# Altium schematic sheet Microcontroller (MCU).SchDoc
size A4; SheetNumber: 10; SheetTotal: 10
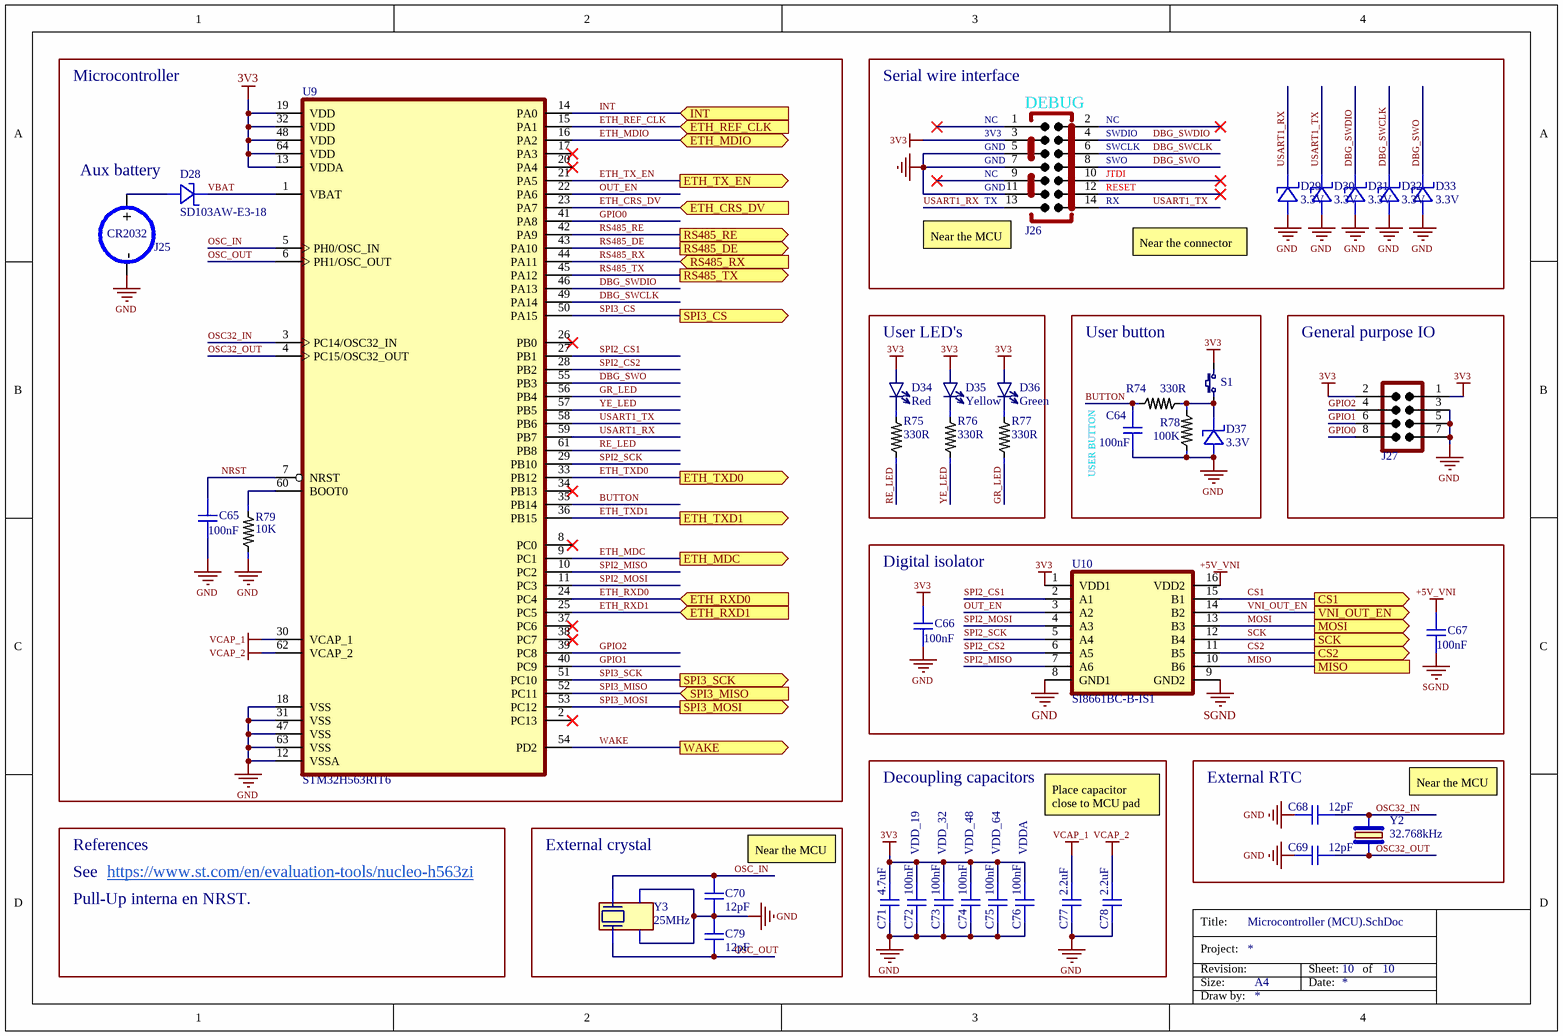
[diagram p0: Microcontroller (MCU).SchDoc]

## Parts
C64  value 100nF  [CAPC1005N]  (hidden comment: Multilayer Ceramic Capacitors)
C65  value 100nF  [CAPC1005N]  (hidden comment: Multilayer Ceramic Capacitors)
C66  value 100nF  [CAPC1005N]  (hidden comment: Multilayer Ceramic Capacitors)
C67  value 100nF  [CAPC1005N]  (hidden comment: Multilayer Ceramic Capacitors)
C68  value 12pF  [CAPC1005N]  (hidden comment: Multilayer Ceramic Capacitors)
C69  value 12pF  [CAPC1005N]  (hidden comment: Multilayer Ceramic Capacitors)
C70  value 12pF  [CAPC1005N]  (hidden comment: Multilayer Ceramic Capacitors)
C71  value 4.7uF  [CAPC1005N]  (hidden comment: Multilayer Ceramic Capacitors)
C72  value 100nF  [CAPC1005N]  (hidden comment: Multilayer Ceramic Capacitors)
C73  value 100nF  [CAPC1005N]  (hidden comment: Multilayer Ceramic Capacitors)
C74  value 100nF  [CAPC1005N]  (hidden comment: Multilayer Ceramic Capacitors)
C75  value 100nF  [CAPC1005N]  (hidden comment: Multilayer Ceramic Capacitors)
C76  value 100nF  [CAPC1005N]  (hidden comment: Multilayer Ceramic Capacitors)
C77  value 2.2uF  [CAPC1005N]  (hidden comment: Multilayer Ceramic Capacitors)
C78  value 2.2uF  [CAPC1005N]  (hidden comment: Multilayer Ceramic Capacitors)
C79  value 12pF  [CAPC1005N]  (hidden comment: Multilayer Ceramic Capacitors)
D28  Part Number: SD103AW-E3-18  [SOD3705X110-2N]  (hidden comment: Schottky Diodes)
D29  value 3.3V  [SOD2512X110N]  (hidden comment: ESD Protection Diodes)
D30  value 3.3V  [SOD2512X110N]  (hidden comment: ESD Protection Diodes)
D31  value 3.3V  [SOD2512X110N]  (hidden comment: ESD Protection Diodes)
D32  value 3.3V  [SOD2512X110N]  (hidden comment: ESD Protection Diodes)
D33  value 3.3V  [SOD2512X110N]  (hidden comment: ESD Protection Diodes)
D34  value Red  [LEDC1608X80N_RED]  (hidden comment: Single Color LED)
D35  value Yellow  [LEDC1608X80N_YELLOW]  (hidden comment: Single Color LED)
D36  value Green  [LEDC1608X80N_GREEN]  (hidden comment: Single Color LED)
D37  value 3.3V  [SOD2512X110N]  (hidden comment: ESD Protection Diodes)
J25  Cell Battery Holders  [CONB_BH_CR2032-2N]  (value not drawn)
J26  Male straight header  [CONH_ML127P-14N]  (value not drawn)
J27  Male straight header  [CONH_ML254P-SMT-8N]  (value not drawn)
R74  value 330R  [RESC1005N]  (hidden comment: Thick Film Resistors)
R75  value 330R  [RESC1005N]  (hidden comment: Thick Film Resistors)
R76  value 330R  [RESC1005N]  (hidden comment: Thick Film Resistors)
R77  value 330R  [RESC1005N]  (hidden comment: Thick Film Resistors)
R78  value 100K  [RESC1005N]  (hidden comment: Thick Film Resistors)
R79  value 10K  [RESC1005N]  (hidden comment: Thick Film Resistors)
S1  Tactile Switches  [PKG3.5X6-2N]  (value not drawn)
U9  Part Number: STM32H563RIT6  [QFP50P1200X1200X160-64N]  (hidden comment: ARM Cortex M33 MCU)
U10  Part Number: SI8661BC-B-IS1  [SOIC127P1030X265-16N]  (hidden comment: Digital Isolators)
Y2  value 32.768kHz  [XTAL3215]  (hidden comment: Crystal)
Y3  value 25MHz  [XTAL3225]  (hidden comment: Crystal)

## Blocks framed on the sheet
User LED's: D34-D36 R75-R77
User button: C64 D37 R74 R78 S1
General purpose IO: J27
Digital isolator: C66 C67 U10
Decoupling capacitors: C71-C78
External RTC: C68 C69 Y2
External crystal: C70 C79 Y3

## Ports
CS1 (out, see Main[3C], Digital Input (DIN)[1C]), CS2 (out, see Main[3C], Digital Output (DOUT)[1C]), ETH_CRS_DV (in, see Main[2B], Ethernet Interface (ETH)[2B]), ETH_MDC (out, see Main[2B], Ethernet Interface (ETH)[2B]), ETH_MDIO (bidir, see Main[2B], Ethernet Interface (ETH)[2B]), ETH_REF_CLK (in, see Main[2B], Ethernet Interface (ETH)[2B]), ETH_RXD0 (in, see Main[2B], Ethernet Interface (ETH)[2B]), ETH_RXD1 (in, see Main[2B], Ethernet Interface (ETH)[2B]), ETH_TX_EN (out, see Main[2B], Ethernet Interface (ETH)[2B]), ETH_TXD0 (out, see Main[2B], Ethernet Interface (ETH)[2A]), ETH_TXD1 (out, see Main[2B], Ethernet Interface (ETH)[2B]), INT (in, see Main[2C], RF Transceiver Module (RF)[1B]), MISO (see Main[3C], Digital Input (DIN)[1C], Digital Output (DOUT)[1C]), MOSI (out, see Main[3B], Digital Input (DIN)[1C], Digital Output (DOUT)[1C]), RS485_DE (out, see Main[3B], Industrial Serial Comm (RS485)[1B]), RS485_RE (out, see Main[3B], Industrial Serial Comm (RS485)[1B]), RS485_RX (in, see Main[3B], Industrial Serial Comm (RS485)[1B]), RS485_TX (out, see Main[3B], Industrial Serial Comm (RS485)[1B]), SCK (out, see Main[3C], Digital Input (DIN)[1C], Digital Output (DOUT)[1C]), SPI3_CS (out, see Main[2C], RF Transceiver Module (RF)[2B]), SPI3_MISO (in, see Main[2C], RF Transceiver Module (RF)[2B]), SPI3_MOSI (out, see Main[2C], RF Transceiver Module (RF)[1B]), SPI3_SCK (out, see Main[2C], RF Transceiver Module (RF)[1B]), VNI_OUT_EN (out, see Main[3C], Digital Output (DOUT)[2B]), WAKE (out, see Main[2C], RF Transceiver Module (RF)[1B])

## Nets
3V3: C66.1 C71.1 C72.1 C73.1 C74.1 C75.1 C76.1 D34.A D35.A D36.A J26.3 J27.1 J27.2 S1.2 U9.13(VDDA) U9.19(VDD) U9.32(VDD) U9.48(VDD) U9.64(VDD) U10.1(VDD1)
+5V_VNI: C67.1 U10.16(VDD2)
GND: C64.2 C65.2 C66.2 C68.2 C69.2 C70.2 C71.2 C72.2 C73.2 C74.2 C75.2 C76.2 C77.2 C78.2 C79.1 D29.A D30.A D31.A D32.A D33.A D37.A J25.1(-) J26.5 J26.7 J26.11 J27.3 J27.5 J27.7 R78.1 R79.1 U9.12(VSSA) U9.18(VSS) U9.31(VSS) U9.47(VSS) U9.63(VSS) U10.8(GND1) Y3.2(GND) Y3.4(GND)
SGND: C67.2 U10.9(GND2)
VCAP_1: C77.1 U9.30(VCAP_1)
VCAP_2: C78.1 U9.62(VCAP_2)
BUTTON: C64.1 R74.1 U9.35(PB14)
CS1: U10.15(B1) ; port CS1
CS2: U10.11(B5) ; port CS2
DBG_SWCLK: D32.C J26.6 U9.49(PA14)
DBG_SWDIO: D31.C J26.4 U9.46(PA13)
DBG_SWO: D33.C J26.8 U9.55(PB3)
ETH_CRS_DV: U9.23(PA7) ; port ETH_CRS_DV
ETH_MDC: U9.9(PC1) ; port ETH_MDC
ETH_MDIO: U9.16(PA2) ; port ETH_MDIO
ETH_REF_CLK: U9.15(PA1) ; port ETH_REF_CLK
ETH_RXD0: U9.24(PC4) ; port ETH_RXD0
ETH_RXD1: U9.25(PC5) ; port ETH_RXD1
ETH_TX_EN: U9.21(PA5) ; port ETH_TX_EN
ETH_TXD0: U9.33(PB12) ; port ETH_TXD0
ETH_TXD1: U9.36(PB15) ; port ETH_TXD1
GPIO0: J27.8 U9.41(PA8)
GPIO1: J27.6 U9.40(PC9)
GPIO2: J27.4 U9.39(PC8)
GR_LED: R77.1 U9.56(PB4)
INT: U9.14(PA0) ; port INT
MISO: U10.10(B6) ; port MISO
MOSI: U10.13(B3) ; port MOSI
NRST: C65.1 U9.7(NRST)
OSC32_IN: C68.1 U9.3(PC14/OSC32_IN) Y2.2(CRYSTAL)
OSC32_OUT: C69.1 U9.4(PC15/OSC32_OUT) Y2.1(CRYSTAL)
OSC_IN: C70.1 U9.5(PH0/OSC_IN) Y3.1(IN/OUT)
OSC_OUT: C79.2 U9.6(PH1/OSC_OUT) Y3.3(OUT/IN)
OUT_EN: U9.22(PA6) U10.3(A2)
RE_LED: R75.1 U9.61(PB8)
RS485_DE: U9.43(PA10) ; port RS485_DE
RS485_RE: U9.42(PA9) ; port RS485_RE
RS485_RX: U9.44(PA11) ; port RS485_RX
RS485_TX: U9.45(PA12) ; port RS485_TX
SCK: U10.12(B4) ; port SCK
SPI2_CS1: U9.27(PB1) U10.2(A1)
SPI2_CS2: U9.28(PB2) U10.6(A5)
SPI2_MISO: U9.10(PC2) U10.7(A6)
SPI2_MOSI: U9.11(PC3) U10.4(A3)
SPI2_SCK: U9.29(PB10) U10.5(A4)
SPI3_CS: U9.50(PA15) ; port SPI3_CS
SPI3_MISO: U9.52(PC11) ; port SPI3_MISO
SPI3_MOSI: U9.53(PC12) ; port SPI3_MOSI
SPI3_SCK: U9.51(PC10) ; port SPI3_SCK
USART1_RX: D29.C J26.13 U9.59(PB7)
USART1_TX: D30.C J26.14 U9.58(PB6)
VBAT: D28.C U9.1(VBAT)
VNI_OUT_EN: U10.14(B2) ; port VNI_OUT_EN
WAKE: U9.54(PD2) ; port WAKE
YE_LED: R76.1 U9.57(PB5)
NetD28_A: D28.A J25.2(+)
NetD34_C: D34.C R75.2
NetD35_C: D35.C R76.2
NetD36_C: D36.C R77.2
NetD37_C: D37.C R74.2 R78.2 S1.1
NetR79_2: R79.2 U9.60(BOOT0)

Not connected (* = marked no-connect by the designer): J26 1* 2* 9* 10* 12*; U9 2(PC13)* 8(PC0)* 17(PA3)* 20(PA4)* 26(PB0)* 34(PB13)* 37(PC6)* 38(PC7)*

## Notes on the sheet
- Microcontroller
- (near J26) Serial wire interface
- (near J26) DEBUG
- Aux battery
- (near J26) NC
- (near J26) GND
- (near J26) 3V3
- (near J26) SWO
- (near J26) SWCLK
- (near J26) SWDIO
- (near J26) JTDI
- (near J26) Near the MCU
- (near J26) TX
- (near J26) RX
- (near J26) RESET
- Near the connector
- USER BUTTON
- (near Y2) Near the MCU
- References
- VDD_19
- VDD_32
- VDD_48
- VDD_64
- VDDA
- Place capacitor close to MCU pad
- See
- Pull-Up interna en NRST.
- https://www.st.com/en/evaluation-tools/nucleo-h563zi
- Near the MCU
- Title:
- Project:
- Revision:
- Size:
- A4
- Sheet:
- Date:
- of
- Draw by:
- (in symbol J-CR2032-H-SMT) CR2032

## Library data of the parts
C64-C67 C72-C76 = C-MLCC-100nF-50V-10%-0402: Multilayer Ceramic Capacitors MLCC - SMD/SMT 50 V 0.1uF X7R 0402 10%; Part Number: CC0402KRX5R9BB104; Manufacturer: YAGEO; Mounting Type: SMT; Mouser Part #: 603-CC402KRX5R9BB104; Digikey Part #: 311-3342-1-ND; JLCPCB Part #: C105882
C68-C70 C79 = C-MLCC-12pF-50V-10%-0402: Multilayer Ceramic Capacitors MLCC - SMD/SMT 50 V 12 pF C0G 0402 1%; Part Number: CC0402FRNPO9BN120; Manufacturer: YAGEO; Mounting Type: SMT; Mouser Part #: 603-CC402FRNPO9BN120; Digikey Part #: 311-1641-1-ND; JLCPCB Part #: C326662
C71 = C-MLCC-4.7uF-10V-10%-0402: Multilayer Ceramic Capacitors MLCC - SMD/SMT 10V 4.7uF X5R 0402 10% HI CV; Part Number: CC0402KRX5R6BB475; Manufacturer: YAGEO; Mounting Type: SMT; Mouser Part #: 603-CC0402KR5R6BB475; Digikey Part #: 13-CC0402KRX5R6BB475CT-ND; JLCPCB Part #: C326586
C77 C78 = C-MLCC-2.2uF-25V-10%-0402: Multilayer Ceramic Capacitors MLCC - SMD/SMT 25V 2.2uF X5R 0402 10% HI CV; Part Number: CC0402KRX5R8BB225; Manufacturer: YAGEO; Mounting Type: SMT; Mouser Part #: 603-CC0402KRX5R8B225; Digikey Part #: 13-CC0402KRX5R8BB225CT-ND; JLCPCB Part #: C723363
D28 = D-SCH-350mA-40V-SOD123: Schottky Diodes & Rectifiers 350mA 40V SOD123; Manufacturer: Vishay Semiconductors; Mounting Type: SMT; Mouser Part #: 78-SD103AW-E3-18; Digikey Part #: SD103AW-E3-18CT-ND; JLCPCB Part #: C181204
D29-D33 D37 = D-TVS-36W-3.3V-SOD323: ESD Protection Diodes / TVS Diodes UNIDIRECTIONAL 3.3V ESD PR; Manufacturer: onsemi; Part Number: ESD7351HT1G; Mounting Type: SMT; Mouser Part #: 863-ESD7351HT1G; Digikey Part #: ESD7351HT1GOSCT-ND; JLCPCB Part #: C19829399
D34 = D-LED-RED-2V-20mA-0603: Standard Single Color LEDs 0603 Red; Part Number: LTST-C190KRKT; Manufacturer: LITEON; Mounting Type: SMT; Mouser Part #: 859-LTST-C190KRKT; Digikey Part #: 160-1436-1-ND; JLCPCB Part #: C94869
D35 = D-LED-YELLOW-2V-20mA-0603: Standard Single Color LEDs 0603 Yellow; Part Number: LTST-C190KSKT; Manufacturer: LITEON; Mounting Type: SMT; Mouser Part #: 859-LTST-C190KSKT; Digikey Part #: 160-1437-1-ND; JLCPCB Part #: C125095
D36 = D-LED-GREEN-2V-20mA-0603: Standard Single Color LEDs 0603 Green; Part Number: LTST-C190KGKT; Manufacturer: LITEON; Mounting Type: SMT; Mouser Part #: 859-LTST-C190KGKT; Digikey Part #: 160-1435-1-ND; JLCPCB Part #: C125094
J25 = J-CR2032-H-SMT: Coin Cell Battery Holders CR2032; Part Number: 1061; Manufacturer: Keystone Electronics; Mounting Type: SMT; Mouser Part #: 534-1061; Digikey Part #: 36-1061-ND; JLCPCB Part #: C238070
J26 = J-14-1P27-HDR-M-SH-SMT: Male straight header, 2 row, 14 positions, 1.27mm pitch, SMD; Manufacturer: SAMTEC; Part Number: FTSH-107-01-F-DV-K; Mounting Type: SMT; Mouser Part #: 200-FTSH10701FDVK; Digikey Part #: 612-FTSH-107-01-F-DV-K-ND; JLCPCB Part #: C7465995
J27 = J-8-2P54-HDR-M-VERT-SMT: Male straight header, 2 row, 8 positions, 2.54mm pitch, SMD; Part Number: 95278-101-08LF; Manufacturer: Amphenol FCI; Mounting Type: SMT; Mouser Part #: 649-95278-101-08LF; Digikey Part #: 609-5752-ND; JLCPCB Part #: C192300
R74-R77 = R-THICK-330R-62.5mW-1%-0402: Thick Film Resistors - SMD General Purpose Chip Resistor 0402, 330Ohms, 1%, 1/16W; Part Number: RC0402FR-07330RL; Manufacturer: YAGEO; Mounting Type: SMT; Mouser Part #: 603-RC0402FR-07330RL; Digikey Part #: 311-330LRCT-ND; JLCPCB Part #: C105875
R78 = R-THICK-100K-62.5mW-1%-0402: Thick Film Resistors - SMD General Purpose Chip Resistor 0402, 100kOhms, 1%, 1/16W; Part Number: RC0402FR-07100KL; Manufacturer: YAGEO; Mounting Type: SMT; Mouser Part #: 603-RC0402FR-07100KL; Digikey Part #: 311-100KLRCT-ND; JLCPCB Part #: C60491
R79 = R-THICK-10K-62.5mW-1%-0402: Thick Film Resistors - SMD General Purpose Chip Resistor 0402, 10kOhms, 1%, 1/16W; Part Number: RC0402FR-0710KL; Manufacturer: YAGEO; Mounting Type: SMT; Mouser Part #: 603-RC0402FR-0710KL; Digikey Part #: 311-10.0KLRCT-ND; JLCPCB Part #: C60490
S1 = S-TACT-NO-6x3.5-SMT: Tactile Switches SMD OFF - (ON); Manufacturer: TE Connectivity; Part Number: FSMSM; Mounting Type: SMT; Mouser Part #: 506-FSMSM; Digikey Part #: 450-1140-ND; JLCPCB Part #: C3012022
U9 = U-STM32H563RI: ARM Microcontrollers - MCU Arm Cortex-M33 32-bit 250 MHz 2 Mbytes Flash 640KB RAM I3C, DCMI, Ethernet, SMPS; Manufacturer: STMicroelectronics; Mounting Type: SMT; Mouser Part #: 511-STM32H563RIT6; Digikey Part #: 497-STM32H563RIT6-ND; JLCPCB Part #: C20619634
U10 = U-SI8661BC-B-IS1: Digital Isolators 3.75 kV 5 forward & 1 reverse 6-channel isolator; Manufacturer: Skyworks; Mounting Type: SMT; Mouser Part #: 634-SI8661BC-B-IS1; Digikey Part #: 336-2120-5-ND; JLCPCB Part #: C528656
Y2 = Y-XTAL-32.768kHz-12pF-20ppm-3215-SMT: Crystals 32.768KHz 20ppm 12.5pF -40C +85C; Part Number: ECS-.327-12.5-34B-TR; Manufacturer: ECS; Mounting Type: SMT; Mouser Part #: 520-327-12.5-34B; Digikey Part #: 50-ECS-.327-12.5-34B-TRCT-ND; JLCPCB Part #: C32346
Y3 = Y-XTAL-25MHz-12pF-20ppm-3225-SMT: Crystals 25MHz 12pF 20ppm -40C +125C; Manufacturer: ECS; Part Number: ECS-250-12-33Q-JES-TR; Mounting Type: SMT; Mouser Part #: 520-250-12-33Q-JEST; Digikey Part #: XC2151CT-ND; JLCPCB Part #: C91750